# EAGLE design ShineSensor (EAGLE 7.2.0)
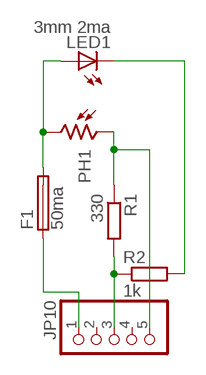
[diagram p0: schematic, sheet 1]

## Parts
F1  50ma  MF-SMDF050  [MF-SMDF050]
JP10  PINHD-1X5  [1X05]
LED1  3mm 2ma  TLLY4400  [LED3MM]
PH1  B1060_23  [TO-8_B10]
R1  330  R-EU_R1206  [R1206]
R2  1k  R-EU_R1206  [R1206]

## Nets
N$1: F1.2 LED1.A PH1.2
N$2: LED1.K(C) R2.2
N$13: JP10.5 PH1.1 R1.1
N$14: JP10.3 R1.2 R2.1
N$15: F1.1 JP10.1
Unconnected: JP10.2 JP10.4

## Library data of the parts
F1 = fuse:MF-SMDF: MF-SMDF Series - PRC Resettable Fuses Source: http://www.farnell.com/datasheets/716597.pdf
JP10 = pinhead:PINHD-1X5: PIN HEADER
LED1 = led:TLLY4400: Low Current (2mA) LED 3 mm Tinted Diffused Package color YELLOW Source: Data sheet <http://www.farnell.com/datasheets/391098.pdf>; MF: VISHAY SEMICONDUCTOR; OC_FARNELL: 1612439
PH1 = photo-elements:?1060*: Sensor Street Light control Source: http://optoelectronics.perkinelmer.com/content/Datasheets/DTS_PhotocellsB1060.pdf
R1 R2 = rcl:R-EU_: RESISTOR, European symbol

## Board
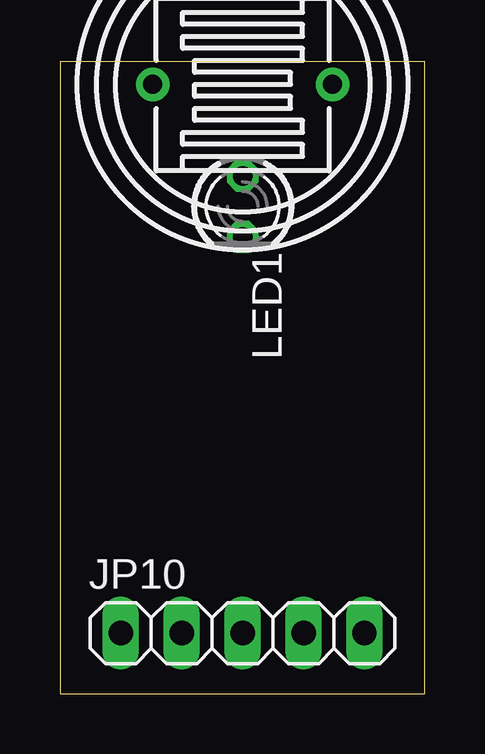
[diagram p1: board, top side]
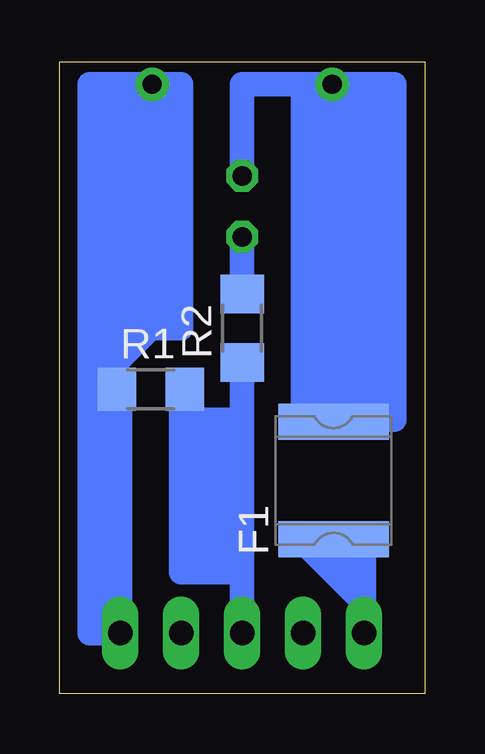
[diagram p2: board, bottom side, seen from below]

Size 15.22 x 26.34 mm. Coordinates in mm from the lower left corner, seen from the top.
Outline: 0,0 15.22,0 15.22,26.34 0,26.34 0,0
Copper layers (1*16): Top 0.035mm / dielectric 1.5mm / Bottom 0.035mm
Design rules "default": minimum track width 10mil, minimum drill 24mil, track to track 8mil, track to pad 8mil, pad to pad 8mil, via to via 8mil, smd to smd 8mil, copper to edge 40mil, drill to drill 8mil, minimum pad ring 10mil, minimum via ring 8mil, stop-mask expansion 4mil, vias tented up to drill 0mil, thermal gap 10mil

### Footprints (pad centres in the part's own frame; a part is rotated, then mirrored left to right if it is on the bottom)
MF-SMDF050 = smd 1.5 x 4.6: 1 -2.45,0; 2 2.45,0
1X05 = drill 1.016 long: 1 -5.08,0; 2 -2.54,0; 3 0,0; 4 2.54,0; 5 5.08,0
LED3MM = drill 0.813 octagon: A -1.27,0; K 1.27,0
TO-8_B10 = drill 0.8 pad 1.4: 1 -3.75,0; 2 3.75,0
R1206 = smd 1.6 x 1.803: 1 -1.422,0; 2 1.422,0

### Placement (x,y rotation side)
F1  3.81,8.89 90 bottom
JP10  7.62,2.54 0 top
LED1  7.62,20.32 270 top
PH1  7.62,25.4 180 top
R1  11.43,12.7 0 bottom
R2  7.62,15.24 90 bottom

### Tracks (layer width: path | path; a pad name or v marks a point on that pad's centre or on a via)
N$1
  Bottom 1.016: PH1.2 3.81,25.4 | LED1.A 7.62,25.4 5.08,25.4 | 5.08,25.4 PH1.2 | 3.81,25.4 F1.2 | 3.81,25.4 1.27,25.4 | 1.27,25.4 1.27,19.05 | 1.27,19.05 1.27,11.43 2.54,11.43 | 2.54,11.43 5.08,11.43 5.08,17.78 | 5.08,17.78 5.08,22.86 | 5.08,22.86 5.08,25.4 | PH1.2 2.54,25.4 2.54,15.24 | 2.54,11.43 2.54,15.24 | 2.54,15.24 5.08,17.78 | 5.08,17.78 2.54,17.78 1.27,19.05 | 1.27,19.05 5.08,22.86 | 5.08,22.86 3.81,22.86 1.27,25.4
N$2
  Bottom 1.016: LED1.K R2.2
N$13
  Bottom 1.016: 12.7,12.7 R1.1 12.85,25.4 | 12.85,25.4 11.43,25.4 | 11.43,25.4 PH1.1 10.16,25.4 10.16,15.24 11.43,15.24 | 12.85,25.4 13.97,25.4 13.97,13.97 | 13.97,13.97 13.97,2.54 JP10.5 12.7,12.7 | 12.7,12.7 13.97,13.97 | 13.97,13.97 12.7,13.97 11.43,15.24 | 11.43,15.24 11.43,25.4 | 12.7,15.24 11.43,15.24
N$14
  Bottom 1.016: 7.62,11.43 7.62,5.08 | 10.01,12.55 R1.2 10.01,11.43 7.62,11.43 | R2.1 7.62,11.43 | JP10.3 7.62,5.08 | 7.62,5.08 10.16,5.08 10.16,12.7
N$15
  Bottom 1.016: F1.1 2.54,6.44 2.54,5.08 | 5.08,6.35 2.54,3.81 JP10.1 2.54,5.08 | 2.54,5.08 3.81,6.35
(copper drawn outside any net)
  shapes: Bottom area x4